# Altium schematic sheet NEW_7V_Buck_LDO_Power.SchDoc
size 215 x 139 mm; SheetNumber: 4; SheetTotal: 6
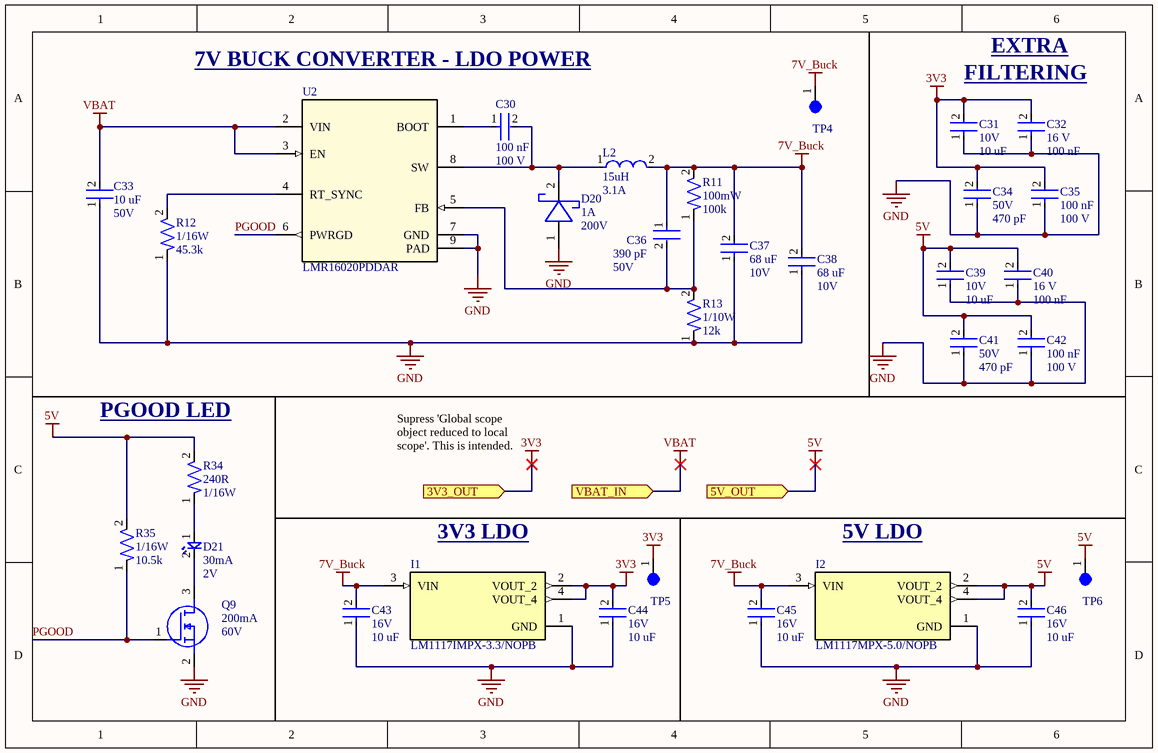
[diagram p0: NEW_7V_Buck_LDO_Power.SchDoc]

## Parts
C30  Capacitance: 100 nF  Voltage: 100 V  [CAP-0603]  (hidden comment: CC0603KRX7R0BB104)
C31  Voltage: 10V  Capacitance: 10 uF  [CAP-0603]  (hidden comment: CC0603KRX5R6BB106)
C32  Voltage Rating: 16 V  Capacitance: 100 nF  [CAP-0402]  (hidden comment: CC0402KRX7R7BB104)
C33  Voltage: 50V  Capacitance: 10 uF  [CAP-1210]  (hidden comment: CL32B106KBJNNNE)
C34  Voltage: 50V  Capacitance: 470 pF  [CAP-0805]  (hidden comment: CC0805JRNPO9BN471)
C35  Capacitance: 100 nF  Voltage: 100 V  [CAP-0603]  (hidden comment: CC0603KRX7R0BB104)
C36  Capacitance: 390 pF  Voltage: 50V  [CAP-0402]  (hidden comment: GRM155R71H391KA01D)
C37  Capacitance: 68 uF  Voltage: 10V  [CAP-1210]  (hidden comment: C5750X5R1A686MT000N)
C38  Capacitance: 68 uF  Voltage: 10V  [CAP-1210]  (hidden comment: C5750X5R1A686MT000N)
C39  Voltage: 10V  Capacitance: 10 uF  [CAP-0603]  (hidden comment: CC0603KRX5R6BB106)
C40  Voltage Rating: 16 V  Capacitance: 100 nF  [CAP-0402]  (hidden comment: CC0402KRX7R7BB104)
C41  Voltage: 50V  Capacitance: 470 pF  [CAP-0805]  (hidden comment: CC0805JRNPO9BN471)
C42  Capacitance: 100 nF  Voltage: 100 V  [CAP-0603]  (hidden comment: CC0603KRX7R0BB104)
C43  Voltage: 16V  Capacitance: 10 uF  [CAP-1210]  (hidden comment: 293D106X9016A2TE3)
C44  Voltage: 16V  Capacitance: 10 uF  [CAP-1210]  (hidden comment: 293D106X9016A2TE3)
C45  Voltage: 16V  Capacitance: 10 uF  [CAP-1210]  (hidden comment: 293D106X9016A2TE3)
C46  Voltage: 16V  Capacitance: 10 uF  [CAP-1210]  (hidden comment: 293D106X9016A2TE3)
D20  Current Rating: 1A  Reverse Voltage: 200V  [SMA_DIO]  (hidden comment: SS1200)
D21  Forward Current: 30mA  Forward Voltage: 2V  [LED-0603]  (hidden comment: BL-HKC36G-AV-TRB)
I1  LM1117IMPX-3.3/NOPB  [IC-SOT-223-4]
I2  LM1117MPX-5.0/NOPB  [IC-SOT-223-4]
L2  Inductance: 15uH  Current Rating: 3.1A  [IND-15UH-0001]  (hidden comment: CSAD1010-150M)
Q9  Continuous Current: 200mA  Voltage: 60V  [IC-SOT23-3]  (hidden comment: T2N7002AK,LM)
R11  Power: 100mW  Resistance: 100k  [RES-0603]  (hidden comment: RC0603FR-07100KL)
R12  Power: 1/16W  Resistance: 45.3k  [RES-0402]  (hidden comment: RC0402FR-0745K3L)
R13  Power: 1/10W  Resistance: 12k  [RES-0603]  (hidden comment: RC0603FR-0712KL)
R34  Resistance: 240R  Power: 1/16W  [RES-0402]  (hidden comment: RC0402FR-07240RL)
R35  Power: 1/16W  Resistance: 10.5k  [RES-0402]  (hidden comment: RC0402FR-0710K5L)
TP4  5003  [TEST-POINT-0001]  (value not drawn)
TP5  5003  [TEST-POINT-0001]  (value not drawn)
TP6  5003  [TEST-POINT-0001]  (value not drawn)
U2  LMR16020PDDAR  [IC-8SOPWR]

## Ports
3V3_OUT (in, see TLD[5B]), 5V_OUT (in, see TLD[5B]), VBAT_IN (in, see TLD[6B], 12V_Buck_Motor[1A])

## Nets
3V3: C31.2 C32.2 C34.2 C35.2 C44.2 I1.2(VOUT_2) I1.4(VOUT_4) TP5.1 ; port 3V3_OUT
5V: C39.2 C40.2 C41.2 C42.2 C46.2 I2.2(VOUT_2) I2.4(VOUT_4) R34.2 R35.2 TP6.1 ; port 5V_OUT
7V_Buck: C36.1 C37.2 C38.2 C43.2 C45.2 I1.3(VIN) I2.3(VIN) L2.2 R11.2 TP4.1
GND: C31.1 C32.1 C33.1 C34.1 C35.1 C37.1 C38.1 C39.1 C40.1 C41.1 C42.1 C43.1 C44.1 C45.1 C46.1 D20.1(CATHODE) I1.1(GND) I2.1(GND) Q9.2(S) R12.1 R13.1 U2.7(GND) U2.9(PAD)
VBAT: C33.2 U2.2(VIN) U2.3(EN) ; port VBAT_IN
PGOOD: Q9.1(G) R35.1 U2.6(PWRGD)
NetC30_1: C30.1 U2.1(BOOT)
NetC30_2: C30.2 D20.2(ANODE) L2.1 U2.8(SW)
NetC36_2: C36.2 R11.1 R13.2 U2.5(FB)
NetD21_1: D21.1 R34.1
NetD21_2: D21.2 Q9.3(D)
NetR12_2: R12.2 U2.4(RT_SYNC)

## Notes on the sheet
- 7V BUCK CONVERTER - LDO POWER
- FILTERING
- EXTRA
- (near R34) PGOOD LED
- Supress 'Global scope object reduced to local scope'. This is intended.
- (near I1) 3V3 LDO
- (near I2) 5V LDO

## Library data of the parts
C30 C35 C42 = CAP-100N-0001: CAP CER 0.1UF 100V X7R 0603; Device Class: Ceramic; Size: 0603; ComponentLink1Description: Datasheet; ComponentLink1URL: https://www.yageo.com/upload/media/product/app/datasheet/mlcc/upy-np0x7r_mv_100-to-630v.pdf
C31 C39 = CAP-10U-0001: CAP CER 10UF 10V X5R 0603; ComponentLink1Description: Datasheet; ComponentLink1URL: https://www.yageo.com/upload/media/product/app/datasheet/mlcc/upy-gphc_x5r_4v-to-50v.pdf; Device Class: Ceramic; Size: 0603
C32 C40 = CAP-0.1U-0001: CAP CER 0.1UF 16V X7R 0402; ComponentLink2Description: Datasheet; ComponentLink2URL: https://www.yageo.com/upload/media/product/productsearch/datasheet/mlcc/UPY-GPHC_X7R_6.3V-to-250V_24.pdf; Device Class: Ceramic; Size: 0402
C33 = CAP-10U-0002: CAP CER 10UF 50V X7R 1210; Device Class: Ceramic; Size: 1210; ComponentLink1Description: Datasheet; ComponentLink1URL: https://mm.digikey.com/Volume0/opasdata/d220001/medias/docus/41/CL32B106KBJNNNE_Spec.pdf
C34 C41 = CAP-470P-0001: CAP CER 470PF 50V C0G/NPO 0805; Device Class: Ceramic; Size: 0805; ComponentLink1Description: Datasheet; ComponentLink1URL: https://www.yageo.com/upload/media/product/productsearch/datasheet/mlcc/UPY-GP_NP0_16V-to-50V_18.pdf
C36 = CAP-390P-0001_1: CAP CER 390PF 50V X7R 0402; Device Class: Ceramic; Size: 0402; ComponentLink1Description: Datasheet; ComponentLink1URL: https://www.lcsc.com/datasheet/lcsc_datasheet_1912111437_Murata-Electronics-GRM155R71H391KA01D_C185563.pdf
C37 C38 = CAP-68U-0001: CAP CER 68UF 10V X5R 2220; Device Class: Ceramic; Size: 2220; ComponentLink1Description: Datasheet; ComponentLink1URL: https://www.lcsc.com/datasheet/lcsc_datasheet_2304140030_TDK-C5750X5R1A686MT000N_C342299.pdf
C43-C46 = CAP-10U-0003: CAP TANT 10UF 10% 16V 1206; Device Class: Tantalum; Size: 1206; ComponentLink1Description: Datasheet; ComponentLink1URL: https://www.lcsc.com/datasheet/lcsc_datasheet_2304140030_Vishay-Intertech-293D106X9016A2TE3_C110038.pdf
D20 = DIO-SCHOTTKY-0004: DIODE SCHOTTKY 200V 1A SMA; ComponentLink1Description: Datasheet; ComponentLink1URL: https://www.digikey.com/en/products/detail/mdd/ss1200/15911596
D21 = LED-0001: LED YELLOW CLEAR 0603 SMD; ComponentLink1Description: Datasheet; ComponentLink1URL: https://www.americanbrightled.com/pdffiles/led-components/smt/BL-HKC36G-AV-TRB.pdf
I1 = IC_LDO_3V3_0001: IC REG LIN 3.3V 800MA SOT223-4; ComponentLink1Description: New link; ComponentLink1URL: https://www.ti.com/lit/ds/symlink/lm1117.pdf?HQS=dis-dk-null-digikeymode-dsf-pf-null-wwe&ts=1721700739746
I2 = IC_LDO_5V_0001: IC REG LINEAR 5V 800MA SOT223-4; ComponentLink1Description: Datasheet; ComponentLink1URL: https://www.ti.com/lit/ds/symlink/lm1117.pdf?HQS=dis-dk-null-digikeymode-dsf-pf-null-wwe&ts=1721700739746
L2 = IND-15U-0001-NoJLC: FIXED IND 15UH 3.1A 50 MOHM SMD; ComponentLink1Description: Datasheet; ComponentLink1URL: https://www.eaton.com/content/dam/eaton/products/electronic-components/resources/data-sheet/eaton-dr1040-shielded-power-inductors-data-sheet.pdf
Q9 = NMOS-200MA-0001: MOSFET N-CH 60V 200MA SOT23; ComponentLink1Description: Datasheet; ComponentLink1URL: https://toshiba.semicon-storage.com/info/T2N7002AK_datasheet_en_20150401.pdf?did=29712&prodName=T2N7002AK
R11 = RES-100k-0001: RES SMD 100K OHM 1% 1/10W 0603; Tolerance: 1%; Size: 0603; ComponentLink1Description: Datasheet; ComponentLink1URL: https://www.yageo.com/upload/media/product/products/datasheet/rchip/PYu-RC_Group_51_RoHS_L_12.pdf
R12 = RES-43.5k-0001: RES 45.3K OHM 1% 1/16W 0402; Tolerance: 1%; Size: 0402; ComponentLink1Description: Datasheet; ComponentLink1URL: https://www.lcsc.com/datasheet/lcsc_datasheet_2304140030_YAGEO-RC0402FR-0745K3L_C137977.pdf
R13 = RES-12k-0001: RES 12K OHM 1% 1/10W 0603; Tolerance: 1%; Size: 0603; ComponentLink1Description: Datasheet; ComponentLink1URL: https://www.lcsc.com/datasheet/lcsc_datasheet_2304140030_YAGEO-RC0603FR-0712KL_C114659.pdf
R34 = RES-240-0001: 240R 0.063W 1% 0402 (1005 Metric)  SMD; Tolerance: 1%; Size: 0402; ComponentLink1Description: Datasheet; ComponentLink1URL: https://www.yageo.com/upload/media/product/products/datasheet/rchip/PYu-RC_Group_51_RoHS_L_12.pdf
R35 = RES-10.5k-0001: RES 10.5K OHM 1% 1/16W 0402; Tolerance: 1%; Size: 0402; ComponentLink1Description: Datasheet; ComponentLink1URL: https://www.yageo.com/upload/media/product/products/datasheet/rchip/PYu-RC_Group_51_RoHS_L_12.pdf
TP4-TP6 = TEST-POINT-0001: Oranange PC Test Point, Miniature Phoisphor Bronze Silver Plating Through Hole Mounting Type
U2 = IC_BUCK_7V_0001: IC REG BUCK ADJ 2A 8SOPWR; ComponentLink1Description: Datasheet; ComponentLink1URL: https://www.ti.com/general/docs/suppproductinfo.tsp?distId=10&gotoUrl=https%3A%2F%2Fwww.ti.com%2Flit%2Fgpn%2Flmr16020